# Altium project Balancing Robot.PrjPcb
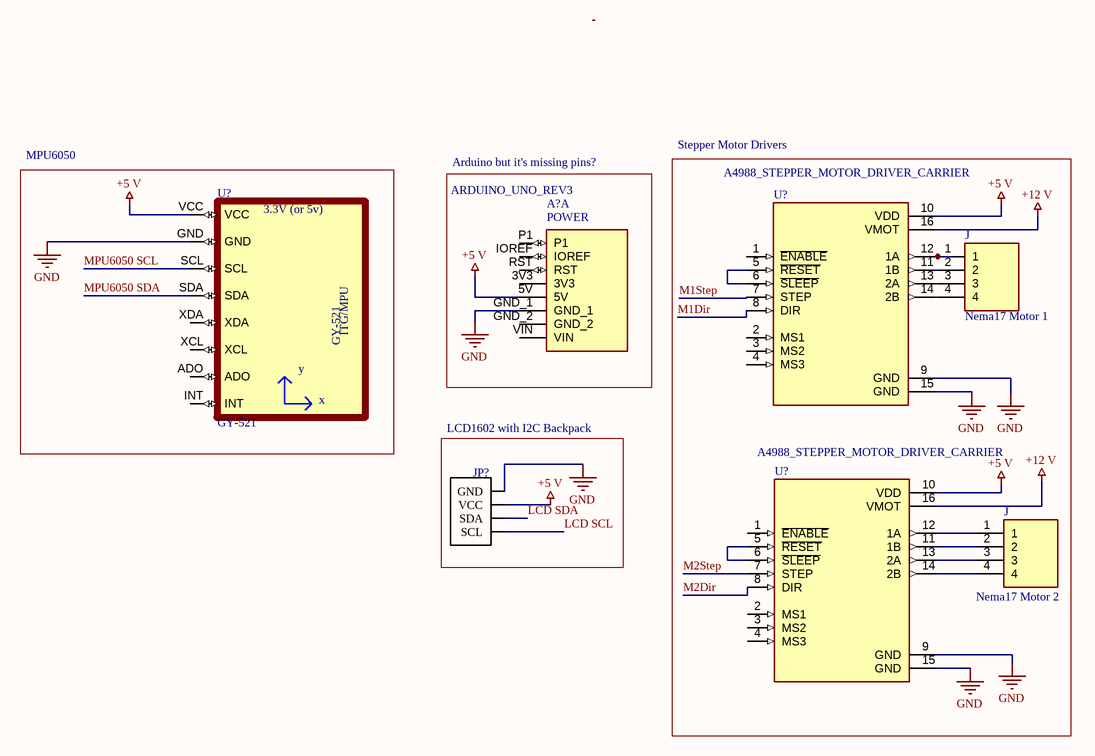
[diagram p0: Schematic.SchDoc]
1 sheet, 7 parts. Net scope: global (net labels, ports and power ports of the same name join across sheets).

## Sheet Schematic.SchDoc
size 431 x 279 mm; Organization: ORGANIZATION; Address1: ADDRESS 1; Address2: ADDRESS 2; Address3: ADDRESS 3; Address4: ADDRESS 4; Revision: -; SheetNumber: 1; SheetTotal: 1; ENG_APP_DATE: --/--/--; DSN_APP_DATE: --/--/--; CHK_APP_DATE: --/--/--

### Parts
(Parts that share a designator on the sheet are numbered #1, #2 ... from top to bottom, then left to right.)
A?  ARDUINO_UNO_REV3  [ARDUINO_ARDUINO_UNO_REV3]  (part A of 4)
J#1  Nema17 Motor 1  [TE_1734598-4]
J#2  Nema17 Motor 2  [TE_1734598-4]
JP?  LCD1602  [*XH_4PIN_LCD1602(Primary)]  (value not drawn)
U?#1  GY-521  [GY-521]
U?#2  A4988_STEPPER_MOTOR_DRIVER_CARRIER  [MODULE_A4988_STEPPER_MOTOR_DRIVER_CARRIER]
U?#3  A4988_STEPPER_MOTOR_DRIVER_CARRIER  [MODULE_A4988_STEPPER_MOTOR_DRIVER_CARRIER]

### Blocks framed on the sheet
Stepper Motor Drivers: J#1 J#2 U?#2 U?#3
MPU6050: U?#1
Arduino but it's missing pins?: A?
LCD1602 with I2C Backpack: JP?

### Nets
+5 V: A?.5V JP?.P$2(VCC) U?#1.VCC U?#2.10(VDD) U?#3.10(VDD)
+12 V: U?#2.16(VMOT) U?#3.16(VMOT)
GND: A?.GND_1 JP?.P$1(GND) U?#1.GND U?#2.9(GND) U?#2.15(GND) U?#3.9(GND) U?#3.15(GND)
LCD SCL: JP?.P$4(SCL)
LCD SDA: JP?.P$3(SDA)
M1Dir: U?#2.8(DIR)
M1Step: U?#2.7(STEP)
M2Dir: U?#3.8(DIR)
M2Step: U?#3.7(STEP)
MPU6050 SCL: U?#1.SCL
MPU6050 SDA: U?#1.SDA
NetJ#1_1: J#1.1 U?#2.12(1A)
NetJ#1_2: J#1.2 U?#2.11(1B)
NetJ#1_3: J#1.3 U?#2.13(2A)
NetJ#1_4: J#1.4 U?#2.14(2B)
NetJ#2_1: J#2.1 U?#3.12(1A)
NetJ#2_2: J#2.2 U?#3.11(1B)
NetJ#2_3: J#2.3 U?#3.13(2A)
NetJ#2_4: J#2.4 U?#3.14(2B)
NetU?#2_5: U?#2.5(~{RESET}) U?#2.6(~{SLEEP})
NetU?#3_5: U?#3.5(~{RESET}) U?#3.6(~{SLEEP})

Not connected (* = marked no-connect by the designer): A? 3V3 GND_2 IOREF P1 RST VIN; U?#1 ADO INT XCL XDA; U?#2 1(~{ENABLE}) 2(MS1) 3(MS2) 4(MS3); U?#3 1(~{ENABLE}) 2(MS1) 3(MS2) 4(MS3)

### Notes on the sheet
- DWG. NO.
- REV.
- SHT.
- THIS DOCUMENT AND THE DATA DISCLOSED HEREIN OR HEREWITH IS THE PROPERTY OF ALTIUM LIMITED AND MAY BE FREELY DISTRIBUTED IN WHOLE. NO RIGHTS ARE RESERVED OR EXPRESS OR IMPLIED WARANTEE GIVEN.
- REVISION
- DESCRIPTION
- DATE
- APPROVED
- ENG:
- APPROVALS
- PROJECT
- DSN:
- CHK:
- REFERENCE DOCUMENTS
- PROJECT REVISION:
- TITLE
- DOCUMENT REVISION:
- DESIGN ITEM:
- BOM:
- FAB DWG:
- PCB DWG:
- ASSY DWG:
- SCALE:
- SIZE
- B
- CAGE CODE
- FILE NAME
- DWG NO.
- SHEET
- OF
- REV
- (in symbol ARDUINO_UNO_REV3, part A) POWER
- (in symbol GY-521) 3.3V (or 5v); ITG/MPU; y; x

### Library data of the parts
A? = ARDUINO_UNO_REV3: Microcontroller board based on the ATmega328P.; MP: ARDUINO UNO REV3; SnapEDA_Link: https://www.snapeda.com/parts/ARDUINO%20UNO%20REV3/Arduino/view-part/?ref=snap; Package: Non-Standard Arduino; Value: *; MF: Arduino; Check_prices: https://www.snapeda.com/parts/ARDUINO%20UNO%20REV3/Arduino/view-part/?ref=eda
J#1 J#2 = 1734598-4: Conn High Performance Interconnect HDR 4 POS 1.25mm Solder ST Thru-Hole Tube; MF: TE Connectivity; EU_RoHS_Compliance: Compliant; Digi-Key_Purchase_URL: https://www.digikey.com/product-detail/en/te-connectivity-amp-connectors/1734598-4/A99916-ND/2074075?utm_source=snapeda&utm_medium=aggregator&utm_campaign=symbol; Digi-Key_Part_Number: A99916-ND; TE_purchase_URL: https://www.te.com/usa-en/product-1734598-4.html?te_bu=Cor&te_type=disp&te_campaign=seda_glo_cor-seda-global-disp-prtnr-fy19-seda-model-bom-cta_sma-317_1&elqCampaignId=32493; Package: None; SnapEDA_Link: https://www.snapeda.com/parts/1734598-4/TE%20Connectivity%20AMP%20Connectors/view-part/2374854/?ref=snap; Value: *; MP: 1734598-4
JP? = LCD1602: BLUE LCD 1602 2x16 Character Mat; MF: kamami; SnapEDA_Link: https://www.snapeda.com/parts/LCD1602/Kaga/view-part/?ref=snap; Package: None; MP: LCD1602; Check_prices: https://www.snapeda.com/parts/LCD1602/Kaga/view-part/?ref=eda; Value: *
U?#1 = GY-521: Triple Axis Accelerometer Gyro Breakout; MF: GODREAM FORDREAM CO., LIMITED; SnapEDA_Link: https://www.snapeda.com/parts/GY-521/GODREAM+FORDREAM+CO.%252C+LIMITED/view-part/?ref=snap; Package: Package; Value: *; MP: GY-521; Check_prices: https://www.snapeda.com/parts/GY-521/GODREAM+FORDREAM+CO.%252C+LIMITED/view-part/?ref=eda
U?#2 U?#3 = A4988_STEPPER_MOTOR_DRIVER_CARRIER: Stepper motor controler; IC: A4988; 1A; Uin mot: 8Ã·35V; Price: None; Value: *; MP: A4988_STEPPER_MOTOR_DRIVER_CARRIER; Package: None; Availability: Unavailable